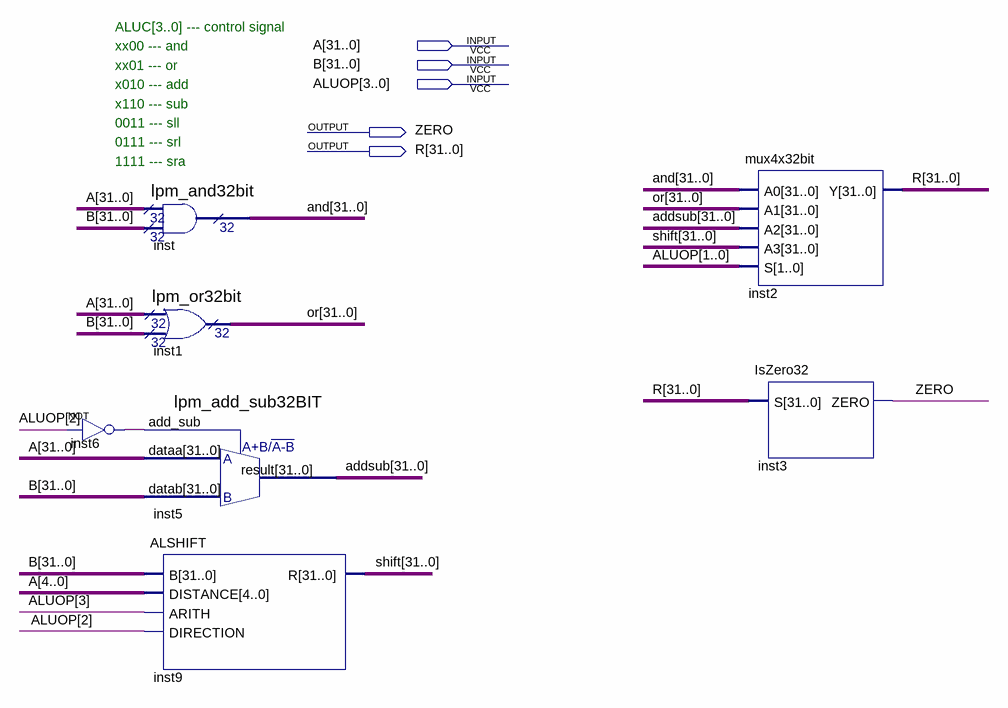
[diagram p0: schematic sheet]
// Quartus schematic ALU.bdf as structural Verilog: 7 symbols, 5 pins
module ALU (
  input  [31:0] A,
  input  [31:0] B,
  input  [3:0] ALUOP,
  output ZERO,
  output [31:0] R
);

  wire inst6_out;
  wire [31:0] addsub, \and , \or , shift;

  not inst6 (inst6_out, ALUOP[2]);
  lpm_and32bit inst (.data0x(A), .data1x(B), .result(\and ));
  lpm_or32bit inst1 (.data0x(A), .data1x(B), .result(\or ));
  lpm_add_sub32BIT inst5 (.dataa(A), .datab(B), .add_sub(inst6_out), .result(addsub));
  ALSHIFT inst9 (.B(B), .DISTANCE(A[4:0]), .ARITH(ALUOP[3]), .DIRECTION(ALUOP[2]), .R(shift));
  mux4x32bit inst2 (.A0(\and ), .A1(\or ), .A2(addsub), .A3(shift), .S(ALUOP[1:0]), .Y(R));
  IsZero32 inst3 (.S(R), .ZERO(ZERO));

  // Notes on the sheet:
  //   ALUC[3..0] --- control signal
  //   xx00 --- and
  //   xx01 --- or
  //   x010 --- add
  //   x110 --- sub
  //   0011 --- sll
  //   0111 --- srl
  //   1111 --- sra
endmodule
